# EasyEDA schematic 1-Schematic_picaxe-SMALL.json
TITLE: New Schematic; REV: 1.0; Date: 2018-07-18; Sheet: 1/1; Drawn By: jirka.svitil
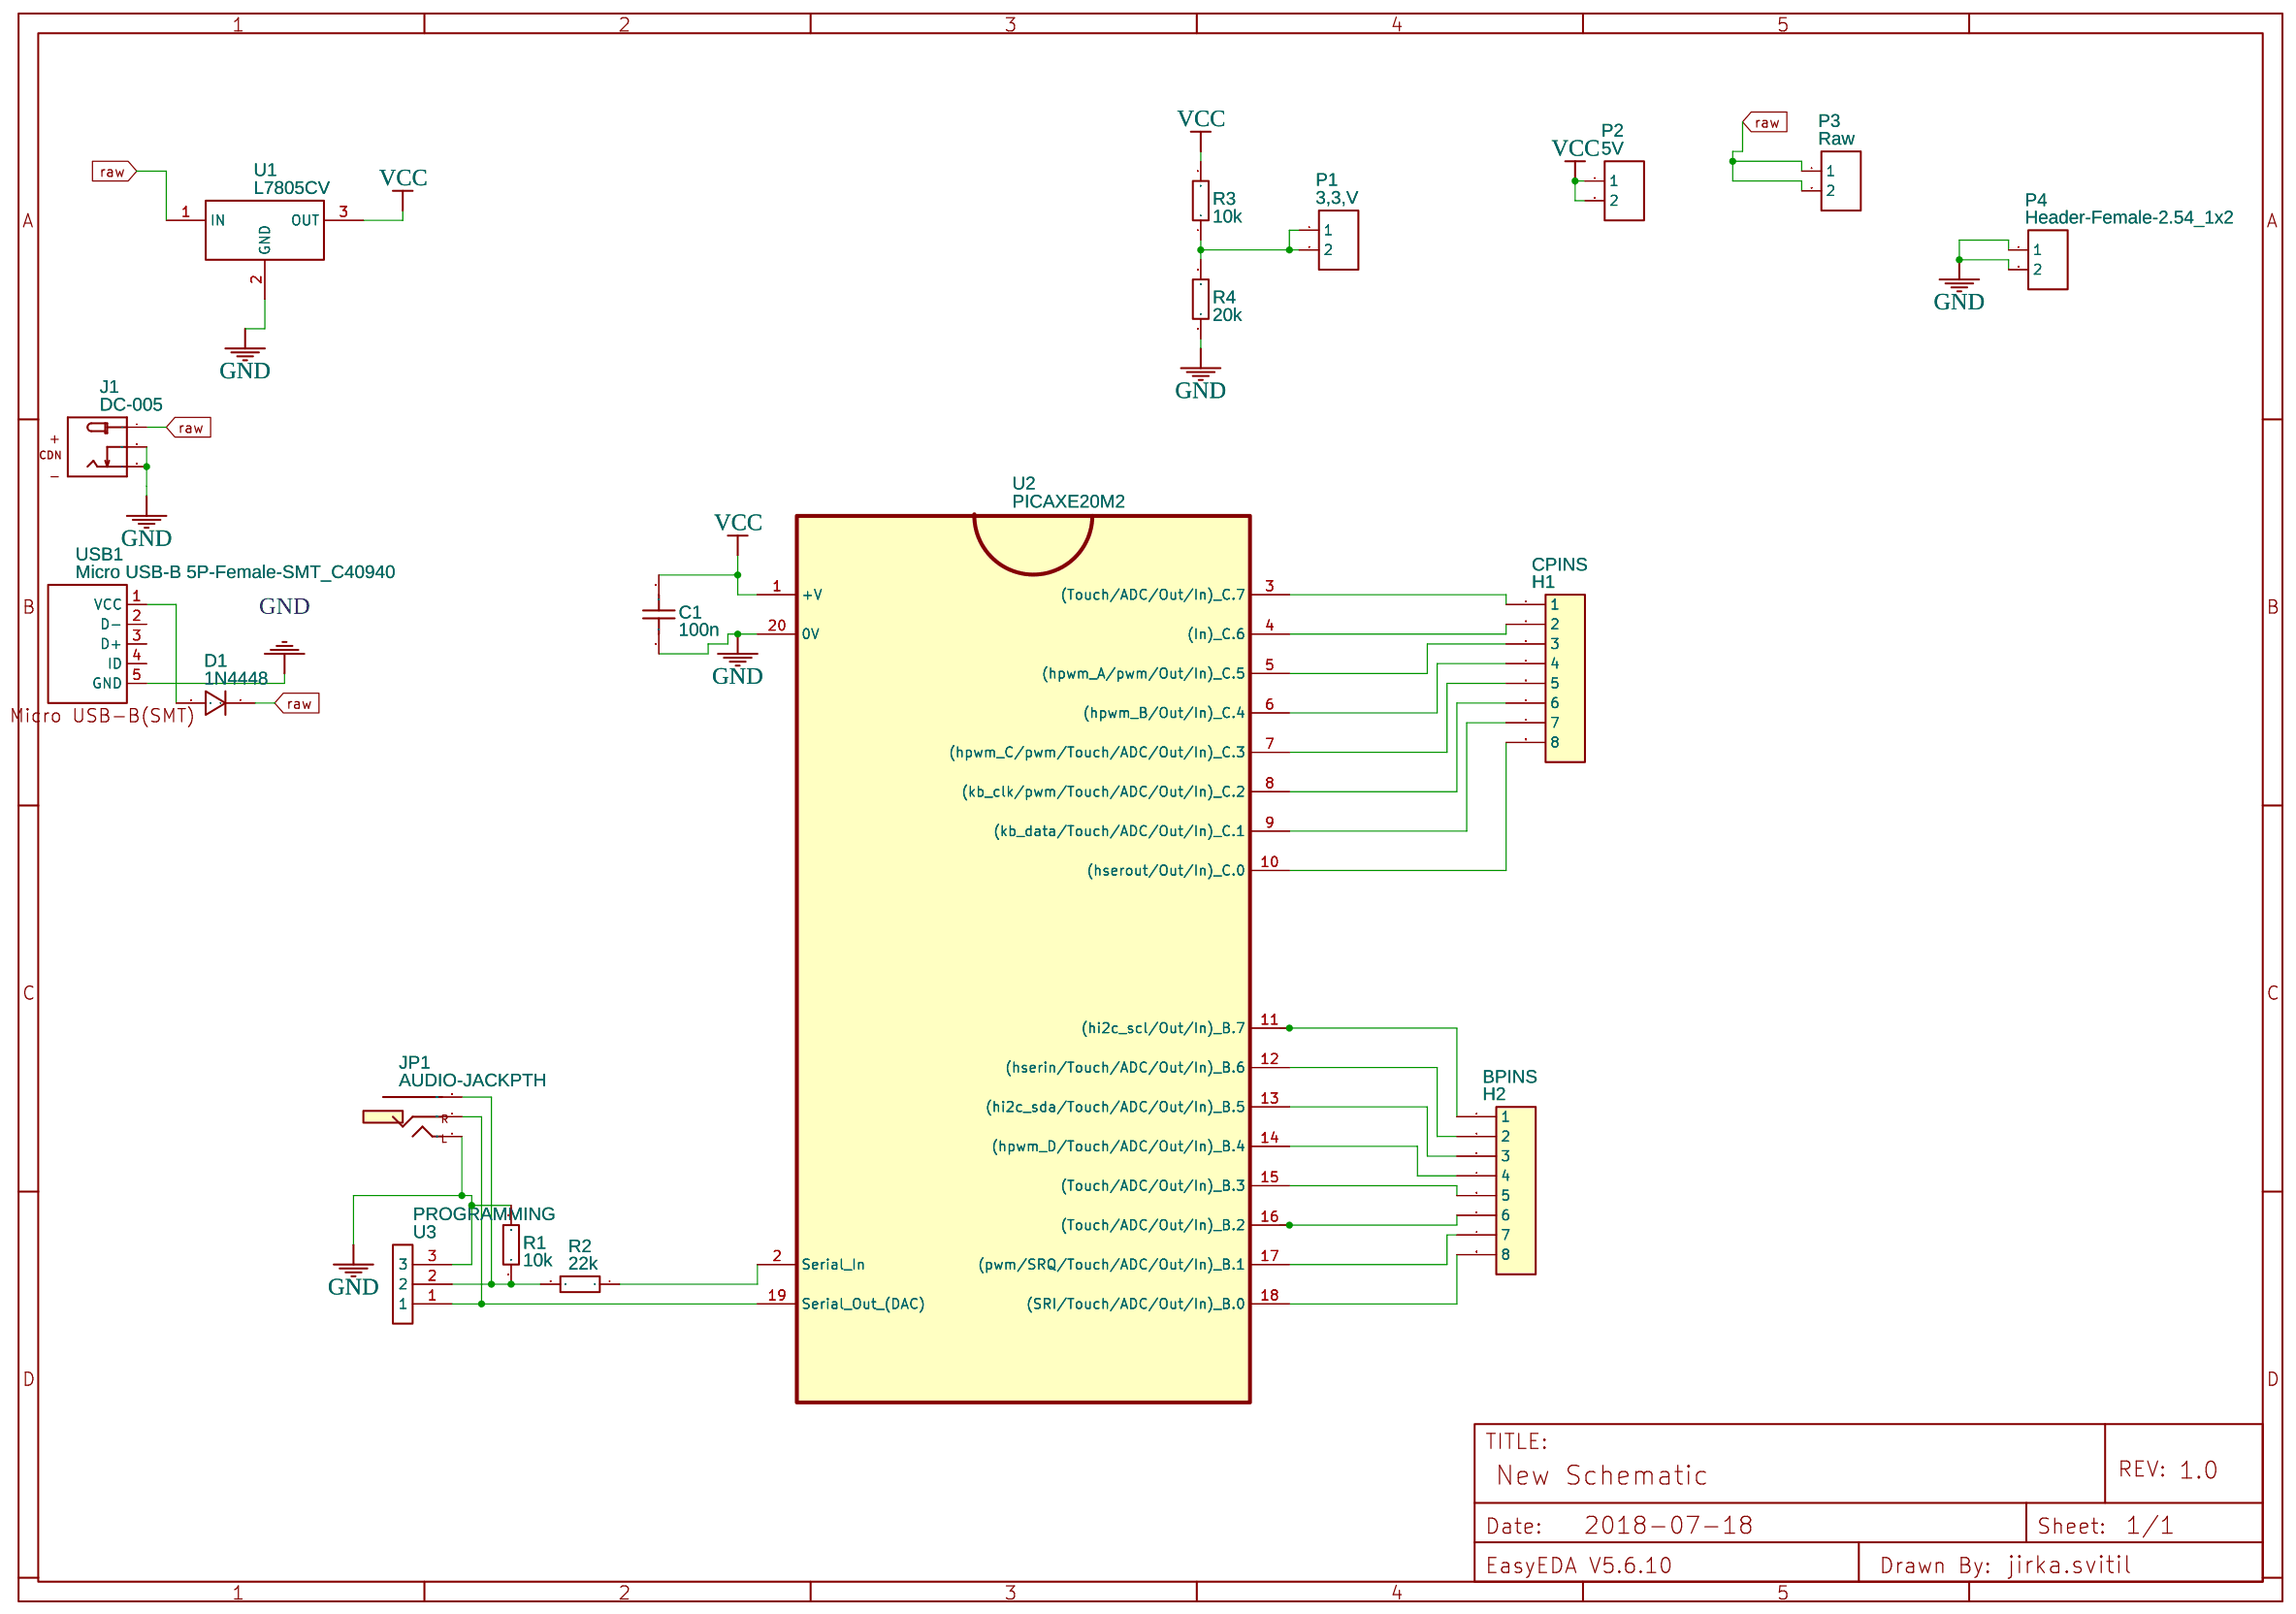
[diagram p0: schematic sheet]

## Parts
BPINS  H2  [8PIN FEMALE HEADER]
C1  100n  [RAD-0.1]
CPINS  H1  [8PIN FEMALE HEADER]
D1  1N4448  [DO-35]
J1  DC-005  [DCJ3P-14.2X11.0X9.0MM]
JP1  AUDIO-JACKPTH  [AUDIO-PJ313D]
P1  3,3,V  [HDR-1X2/2.54]
P2  5V  [HDR-1X2/2.54]
P3  Raw  [HDR-1X2/2.54]
P4  Header-Female-2.54_1x2  [HDR-1X2/2.54]
PROGRAMMING  U3  [3PIN HEADER]
R1  10k  [AXIAL-0.3]
R2  22k  [AXIAL-0.3]
R3  10k  [AXIAL-0.3]
R4  20k  [AXIAL-0.3]
U1  L7805CV  [TO-220(TO-220-3)]
U2  PICAXE20M2  [DIL-20]
USB1  Micro USB-B 5P-Female-SMT_C40940  [MICRO 5P_C40940]

## Library data of the parts
BPINS CPINS = -: Manufacturer Part: ?
C1 = Cap_RAD-0.1_US: Manufacturer Part: ?
D1 = -: Supplier: LCSC; Manufacturer: SEMTECH; LCSC: C54037; image: //image.lceda.cn/szlcsc/C54037.jpg
J1 = -: CONN DC POWER JACK 2.1MM
JP1 = -: 3.5mm Audio Jack; Contributor: SparkFun; Manufacturer Part: ?
P1-P4 = -: Supplier: LCSC; Manufacturer: BOOMELE; Manufacturer Part: 2.54-1*2PFemale; LCSC: C49661; image: //image.lceda.cn/szlcsc/C49661.jpg
PROGRAMMING = -: Manufacturer Part: pin 3; Contributor: goldenrice
R1-R4 = Res_AXIAL-0.3(1/8W)_EU: Manufacturer Part: ?
U1 = -: Supplier: LCSC; Manufacturer: STMicroelectronics; LCSC: C111887; Contributor: LCSC
U2 = -: Manufacturer Part: PICAXE; Contributor: robinek
USB1 = -: Supplier: LCSC; Manufacturer: ValuePro; Manufacturer Part: Micro USB-B 5P-Female-SMT; LCSC: C40940; image: //image.lceda.cn/szlcsc/C40940.jpg; Contributor: LCSC

## Nets
GND: C1.1 J1.-1(-) J1.-2(CDN) JP1.2(LEFT) P4.1 P4.2 PROGRAMMING.3 R1.2 R4.1 U1.2(GND) U2.20(0V) USB1.5(GND)
VCC: C1.2 P2.1 P2.2 R3.2 U1.3(OUT) U2.1(+V)
raw: D1.2(K) J1.+ P3.1 P3.2 U1.1(IN)
Net-(BPINS-1): BPINS.1 U2.11((hi2c scl/Out/In) B.7)
Net-(BPINS-2): BPINS.2 U2.12((hserin/Touch/ADC/Out/In) B.6)
Net-(BPINS-3): BPINS.3 U2.13((hi2c sda/Touch/ADC/Out/In) B.5)
Net-(BPINS-4): BPINS.4 U2.14((hpwm D/Touch/ADC/Out/In) B.4)
Net-(BPINS-5): BPINS.5 U2.15((Touch/ADC/Out/In) B.3)
Net-(BPINS-6): BPINS.6 U2.16((Touch/ADC/Out/In) B.2)
Net-(BPINS-7): BPINS.7 U2.17((pwm/SRQ/Touch/ADC/Out/In) B.1)
Net-(BPINS-8): BPINS.8 U2.18((SRI/Touch/ADC/Out/In) B.0)
Net-(CPINS-1): CPINS.1 U2.3((Touch/ADC/Out/In) C.7)
Net-(CPINS-2): CPINS.2 U2.4((In) C.6)
Net-(CPINS-3): CPINS.3 U2.5((hpwm A/pwm/Out/In) C.5)
Net-(CPINS-4): CPINS.4 U2.6((hpwm B/Out/In) C.4)
Net-(CPINS-5): CPINS.5 U2.7((hpwm C/pwm/Touch/ADC/Out/In) C.3)
Net-(CPINS-6): CPINS.6 U2.8((kb clk/pwm/Touch/ADC/Out/In) C.2)
Net-(CPINS-7): CPINS.7 U2.9((kb data/Touch/ADC/Out/In) C.1)
Net-(CPINS-8): CPINS.8 U2.10((hserout/Out/In) C.0)
Net-(D1-1): D1.1(A) USB1.1(VCC)
Net-(JP1-0): JP1.0(SLEEVE) PROGRAMMING.2 R1.1 R2.2
Net-(JP1-1): JP1.1(RIGHT) PROGRAMMING.1 U2.19(Serial Out (DAC))
Net-(P1-1): P1.1 P1.2 R3.1 R4.2
Net-(R2-1): R2.1 U2.2(Serial In)

Not connected (* = marked no-connect by the designer): USB1 2(D-) 3(D+) 4(ID)
